# Altium schematic sheet cell_fuses.SchDoc
size A3; SheetNumber: 3; SheetTotal: 15; SheetDescription: Cell Fuses
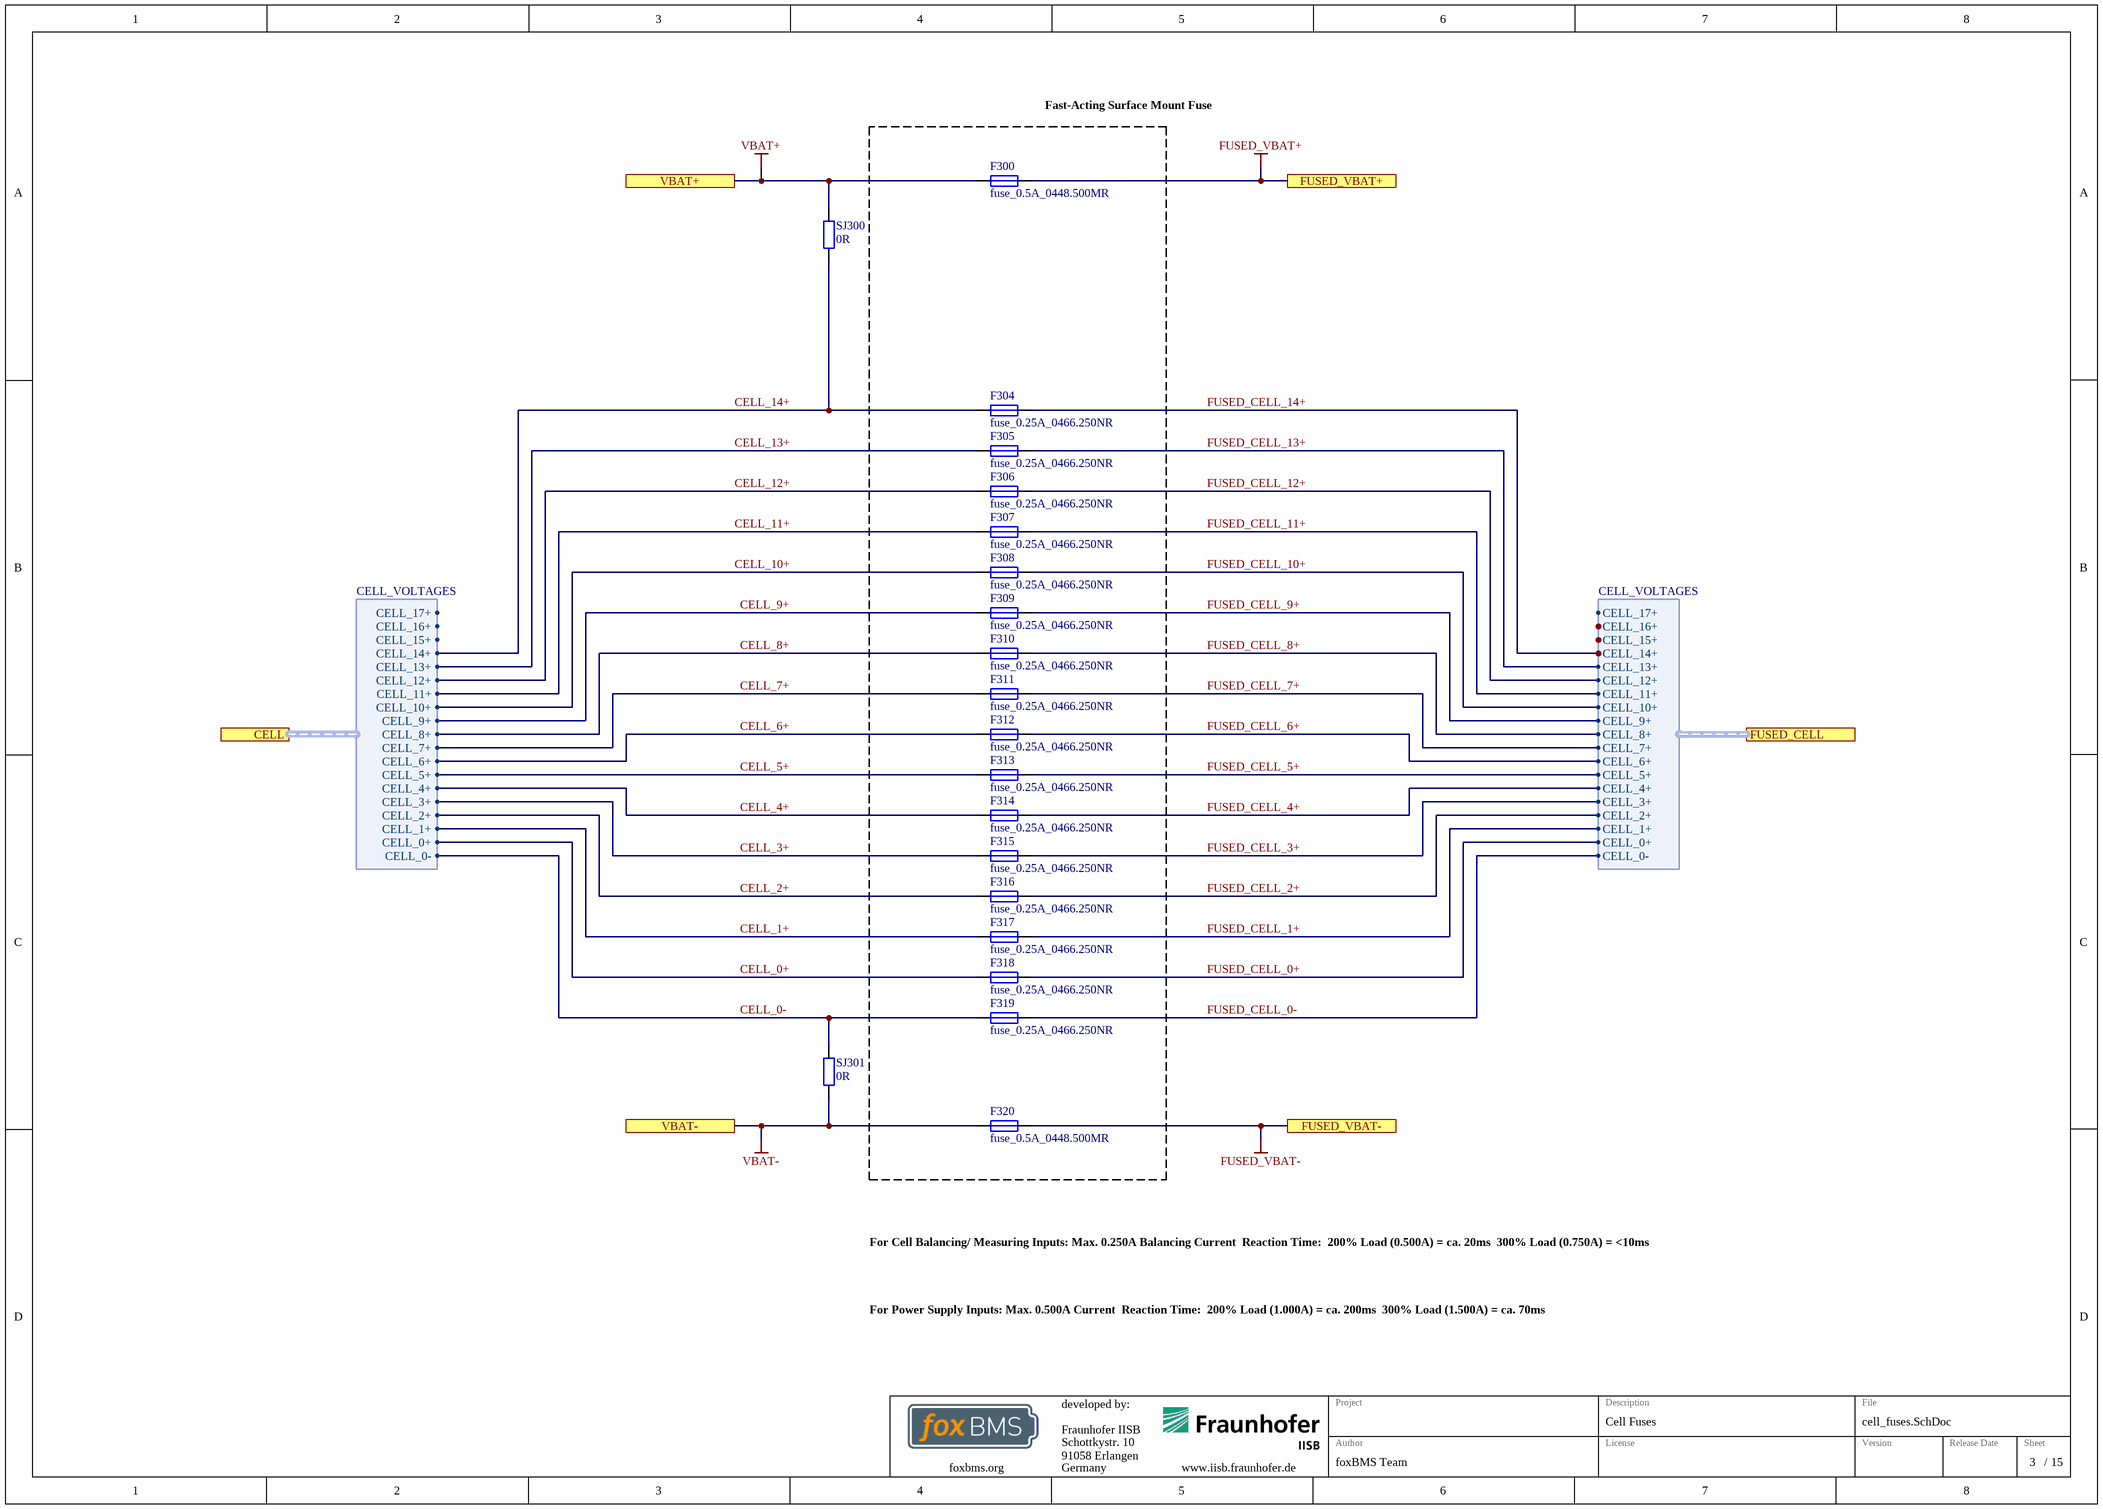
[diagram p0: cell_fuses.SchDoc]

## Parts
F300  fuse_0.5A_0448.500MR  [LITTLEFUSE_448]
F304  fuse_0.25A_0466.250NR  [LITTLEFUSE_466]
F305  fuse_0.25A_0466.250NR  [LITTLEFUSE_466]
F306  fuse_0.25A_0466.250NR  [LITTLEFUSE_466]
F307  fuse_0.25A_0466.250NR  [LITTLEFUSE_466]
F308  fuse_0.25A_0466.250NR  [LITTLEFUSE_466]
F309  fuse_0.25A_0466.250NR  [LITTLEFUSE_466]
F310  fuse_0.25A_0466.250NR  [LITTLEFUSE_466]
F311  fuse_0.25A_0466.250NR  [LITTLEFUSE_466]
F312  fuse_0.25A_0466.250NR  [LITTLEFUSE_466]
F313  fuse_0.25A_0466.250NR  [LITTLEFUSE_466]
F314  fuse_0.25A_0466.250NR  [LITTLEFUSE_466]
F315  fuse_0.25A_0466.250NR  [LITTLEFUSE_466]
F316  fuse_0.25A_0466.250NR  [LITTLEFUSE_466]
F317  fuse_0.25A_0466.250NR  [LITTLEFUSE_466]
F318  fuse_0.25A_0466.250NR  [LITTLEFUSE_466]
F319  fuse_0.25A_0466.250NR  [LITTLEFUSE_466]
F320  fuse_0.5A_0448.500MR  [LITTLEFUSE_448]
SJ300  0R  [RESC1608X05N]
SJ301  0R  [RESC1608X05N]

## Blocks framed on the sheet
Fast-Acting Surface Mount Fuse: F300 F304-F320

## Ports
CELL (harness CELL_VOLTAGES), FUSED_CELL (harness CELL_VOLTAGES), FUSED_VBAT+, FUSED_VBAT-, VBAT+, VBAT-

## Harnesses
CELL_VOLTAGES: CELL_0-, CELL_0+, CELL_1+, CELL_10+, CELL_11+, CELL_12+, CELL_13+, CELL_14+, CELL_15+, CELL_16+, CELL_17+, CELL_2+, CELL_3+, CELL_4+, CELL_5+, CELL_6+, CELL_7+, CELL_8+, CELL_9+

## Nets
FUSED_VBAT+: F300.2 ; port FUSED_VBAT+
FUSED_VBAT-: F320.2 ; port FUSED_VBAT-
VBAT+: F300.1 SJ300.1 ; port VBAT+
VBAT-: F320.1 SJ301.2 ; port VBAT-
CELL_0+: F318.1 ; port CELL.CELL_0+
CELL_0-: F319.1 SJ301.1 ; port CELL.CELL_0-
CELL_1+: F317.1 ; port CELL.CELL_1+
CELL_2+: F316.1 ; port CELL.CELL_2+
CELL_3+: F315.1 ; port CELL.CELL_3+
CELL_4+: F314.1 ; port CELL.CELL_4+
CELL_5+: F313.1 ; port CELL.CELL_5+
CELL_6+: F312.1 ; port CELL.CELL_6+
CELL_7+: F311.1 ; port CELL.CELL_7+
CELL_8+: F310.1 ; port CELL.CELL_8+
CELL_9+: F309.1 ; port CELL.CELL_9+
CELL_10+: F308.1 ; port CELL.CELL_10+
CELL_11+: F307.1 ; port CELL.CELL_11+
CELL_12+: F306.1 ; port CELL.CELL_12+
CELL_13+: F305.1 ; port CELL.CELL_13+
CELL_14+: F304.1 SJ300.2 ; port CELL.CELL_14+
FUSED_CELL_0+: F318.2 ; port FUSED_CELL.CELL_0+
FUSED_CELL_0-: F319.2 ; port FUSED_CELL.CELL_0-
FUSED_CELL_1+: F317.2 ; port FUSED_CELL.CELL_1+
FUSED_CELL_2+: F316.2 ; port FUSED_CELL.CELL_2+
FUSED_CELL_3+: F315.2 ; port FUSED_CELL.CELL_3+
FUSED_CELL_4+: F314.2 ; port FUSED_CELL.CELL_4+
FUSED_CELL_5+: F313.2 ; port FUSED_CELL.CELL_5+
FUSED_CELL_6+: F312.2 ; port FUSED_CELL.CELL_6+
FUSED_CELL_7+: F311.2 ; port FUSED_CELL.CELL_7+
FUSED_CELL_8+: F310.2 ; port FUSED_CELL.CELL_8+
FUSED_CELL_9+: F309.2 ; port FUSED_CELL.CELL_9+
FUSED_CELL_10+: F308.2 ; port FUSED_CELL.CELL_10+
FUSED_CELL_11+: F307.2 ; port FUSED_CELL.CELL_11+
FUSED_CELL_12+: F306.2 ; port FUSED_CELL.CELL_12+
FUSED_CELL_13+: F305.2 ; port FUSED_CELL.CELL_13+
FUSED_CELL_14+: F304.2 ; port FUSED_CELL.CELL_14+, port FUSED_CELL.CELL_15+, port FUSED_CELL.CELL_16+, port FUSED_CELL.CELL_17+

## Notes on the sheet
- For Cell Balancing/ Measuring Inputs: Max. 0.250A Balancing Current
  Reaction Time:
  200% Load (0.500A) = ca. 20ms
  300% Load (0.750A) = <10ms
- For Power Supply Inputs: Max. 0.500A Current
  Reaction Time:
  200% Load (1.000A) = ca. 200ms
  300% Load (1.500A) = ca. 70ms
- Fraunhofer IISB
- Schottkystr. 10
- developed by:
- 91058 Erlangen
- Germany
- Author
- Project
- License
- Description
- File
- Version
- Release Date
- Sheet
- foxbms.org <https://foxbms.org>
- www.iisb.fraunhofer.de <https://www.iisb.fraunhofer.de/>
- foxBMS Team
- /

## Library data of the parts
F300 F320 = fuse_0.5A_0448.500MR: Fuse, Surface Mount, NANO2 Series, 500 mA, 125 VAC, 32 VDC, Very Fast Acting, SMD; Manufacturer: Littlefuse; Automotive Qualified: False; Part Number: fuse_0.5A_0448.500MR; Operating Temperature: -55°C - +125°C; ComponentLink1Description: Datasheet; ComponentLink1URL: http://www.farnell.com/datasheets/1792947.pdf; Supplier 1: Farnell; Supplier Part Number 1: 1596919
F304-F319 = fuse_0.25A_0466.250NR: Fuse, Surface Mount, 466 Series, 250 mA, 125 VAC, 125 VDC, Very Fast Acting, 1206; Manufacturer: Littlefuse; Automotive Qualified: False; Part Number: fuse_0.25A_0466.250NR; Operating Temperature: -55°C - +90°C; ComponentLink1Description: Datasheet; ComponentLink1URL: http://www.farnell.com/datasheets/1796765.pdf; Supplier 1: Farnell; Supplier Part Number 1: 9921826
SJ300 SJ301 = gen_R_0R_0603: SMD Resistor 0R 0603; Power: 0.1W; Case EIA: 0603; Case Metric: 1608; Maximum Working Voltage: 75V; PnP Package: R_0603; Automotive Qualified: True; Part Number: gen_R_0R_0603; Operating Temperature: -55°C - +155°C; Resistance: 0R; Series: Jumper; PnP Value: 0R; Supplier 1: Farnell; Supplier Part Number 1: 2616580